# EAGLE board camion-grue (EAGLE 8.6.0), part 1 of 2
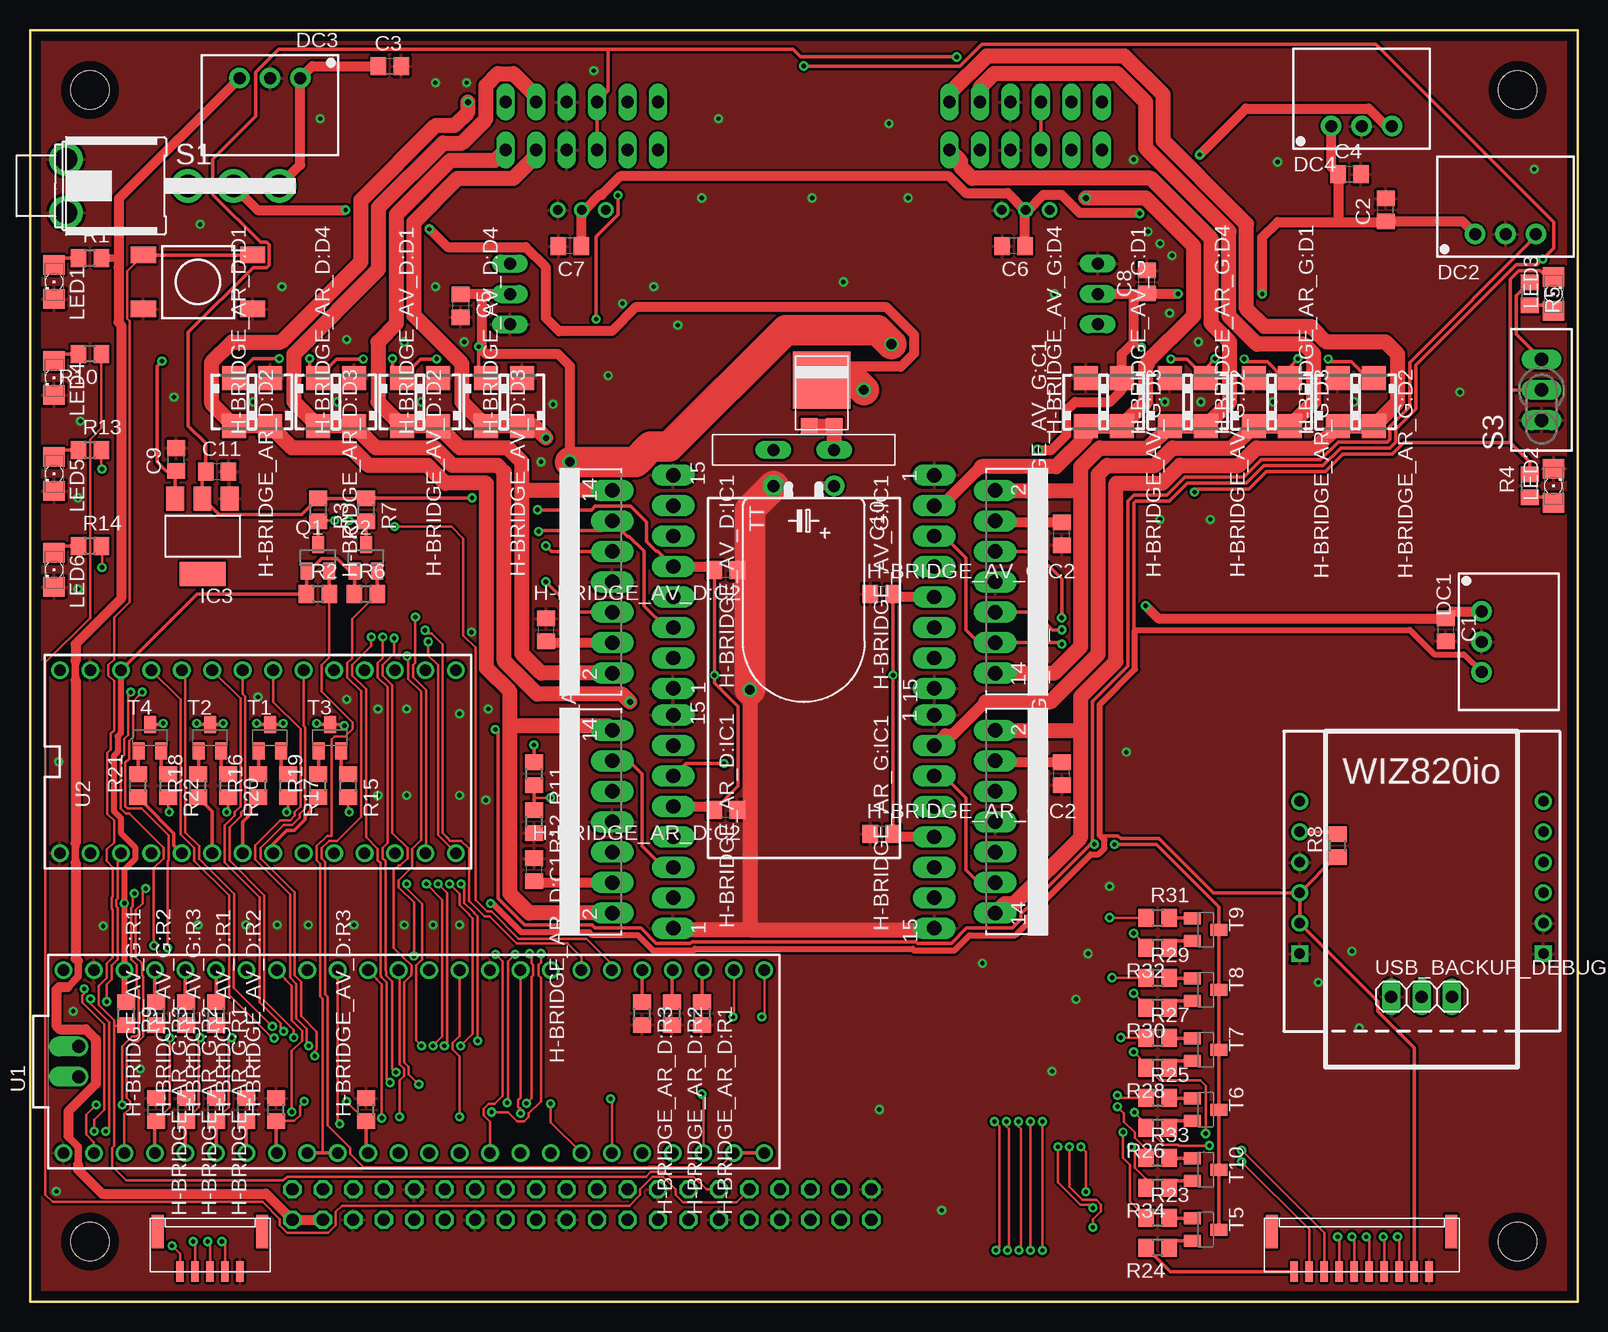
[diagram p2: board, top side]
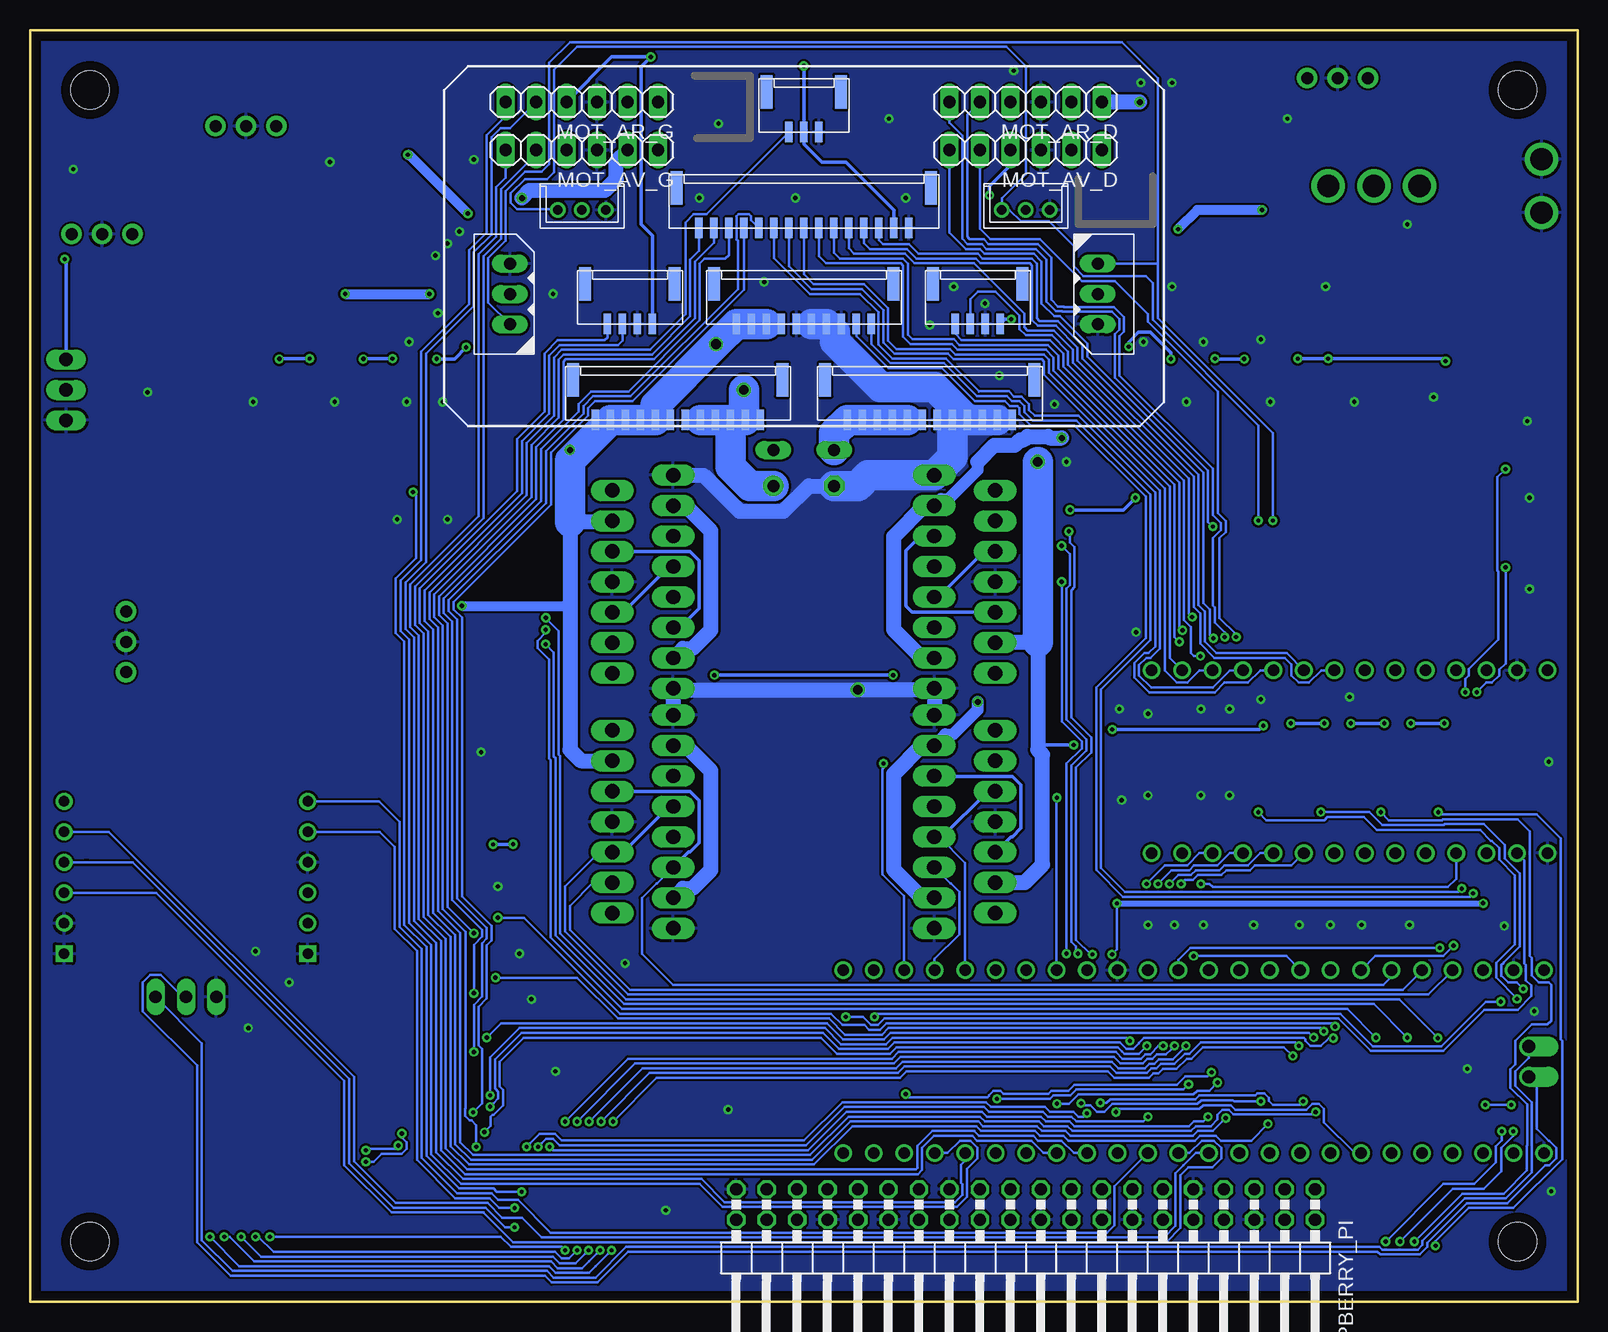
[diagram p3: board, bottom side, seen from below]

Size 129 x 106 mm. Coordinates in mm from the lower left corner, seen from the top.
Outline: 0,0 0,106 129,106 129,0 0,0
Copper layers (1*16): Top 0.035mm / dielectric 1.5mm / Bottom 0.035mm
Design rules "default *": minimum track width 0.2mm, minimum drill 0.35mm, track to track 0.2mm, track to pad 0.2mm, pad to pad 0.2mm, via to via 0.2mm, smd to smd 0.2mm, copper to edge 0.8mm, drill to drill 0.2mm, minimum pad ring 10mil, minimum via ring 8mil, stop-mask expansion 4mil, vias tented up to drill 1mm, thermal gap 10mil
Holes 3.2 mm at 5,5 5,101 124,101 124,5

## Footprints (pad centres in the part's own frame; a part is rotated, then mirrored left to right if it is on the bottom)
GH-12-V = smd 0.6 x 1.7: 1 -6.875,2.5; 2 -5.625,2.5; 3 -4.375,2.5; 4 -3.125,2.5; 5 -1.875,2.5; 6 -0.625,2.5; 7 0.625,2.5; 8 1.875,2.5; 9 3.125,2.5; 10 4.375,2.5; 11 5.625,2.5; 12 6.875,2.5 | smd 1 x 2.8: CASE0 8.725,-0.85; CASE1 -8.725,-0.85
DYNAMIXEL_AX_1X03 = drill 1 long: DATA 2.54,0; DYN_VCC 0,0; GND -2.54,0
C0805 = smd 1.3 x 1.5: 1 -0.95,0; 2 0.95,0
TT5D11L = drill 1 pad 1.676: + -2.54,0 | drill 1 pad 1.676 octagon: - 2.54,0
TO-277A = smd 1.4 x 1.27: +1 -1.04,-1; +2 1.04,-1 | smd 4.8 x 4.72: - 0,2.81
SIP3 = drill 1 pad 1.676: 1 -2.54,0; 2 0,0; 3 2.54,0
GH-05-V = smd 0.6 x 1.7: 1 -2.5,2.5; 2 -1.25,2.5; 3 0,2.5; 4 1.25,2.5; 5 2.5,2.5 | smd 1 x 2.8: CASE0 4.35,-0.85; CASE1 -4.35,-0.85
GH-15-V = smd 0.6 x 1.7: 1 -8.75,2.5; 2 -7.5,2.5; 3 -6.25,2.5; 4 -5,2.5; 5 -3.75,2.5; 6 -2.5,2.5; 7 -1.25,2.5; 8 0,2.5; 9 1.25,2.5; 10 2.5,2.5; 11 3.75,2.5; 12 5,2.5; 13 6.25,2.5; 14 7.5,2.5; 15 8.75,2.5 | smd 1 x 2.8: CASE0 10.6,-0.85; CASE1 -10.6,-0.85
GH-04-V = smd 0.6 x 1.7: 1 -1.875,2.5; 2 -0.625,2.5; 3 0.625,2.5; 4 1.875,2.5 | smd 1 x 2.8: CASE0 3.725,-0.85; CASE1 -3.725,-0.85
GH-10-V = smd 0.6 x 1.7: 1 -5.625,2.5; 2 -4.375,2.5; 3 -3.125,2.5; 4 -1.875,2.5; 5 -0.625,2.5; 6 0.625,2.5; 7 1.875,2.5; 8 3.125,2.5; 9 4.375,2.5; 10 5.625,2.5 | smd 1 x 2.8: CASE0 7.475,-0.85; CASE1 -7.475,-0.85
SMA = smd 2 x 2: A 2,0; C -2,0
MULTIWATT-15 = drill 1.2 long: 1 -8.89,-7.62; 2 -7.62,-2.54; 3 -6.35,-7.62; 4 -5.08,-2.54; 5 -3.81,-7.62; 6 -2.54,-2.54; 7 -1.27,-7.62; 8 0,-2.54; 9 1.27,-7.62; 10 2.54,-2.54; 11 3.81,-7.62; 12 5.08,-2.54; 13 6.35,-7.62; 14 7.62,-2.54; 15 8.89,-7.62
R0805 = smd 1.3 x 1.5: 1 -0.95,0; 2 0.95,0
SOT223 = smd 1.499 x 2.007: 1 -2.261,-3.15; 2 0.025,-3.15; 3 2.311,-3.15 | smd 3.81 x 2.007: 4 0,3.15
GH-03-V = smd 0.6 x 1.7: 1 -1.25,2.5; 2 0,2.5; 3 1.25,2.5 | smd 1 x 2.8: CASE0 3.1,-0.85; CASE1 -3.1,-0.85
1206 = smd 1.6 x 1.803: A -1.422,0; C 1.422,0
1X06 = drill 1.016 long: 1 -6.35,0; 2 -3.81,0; 3 -1.27,0; 4 1.27,0; 5 3.81,0; 6 6.35,0
5MM = drill 1 long: P$1 -2.54,0; P$2 2.54,0
SOT23 = smd 1 x 1.4: 1 -0.95,-1.1; 2 0.95,-1.1; 3 0,1.1
2X20/90 = drill 1.016 octagon: 1 -24.13,-6.35; 2 -24.13,-3.81; 3 -21.59,-6.35; 4 -21.59,-3.81; 5 -19.05,-6.35; 6 -19.05,-3.81; 7 -16.51,-6.35; 8 -16.51,-3.81; 9 -13.97,-6.35; 10 -13.97,-3.81; 11 -11.43,-6.35; 12 -11.43,-3.81; 13 -8.89,-6.35; 14 -8.89,-3.81; 15 -6.35,-6.35; 16 -6.35,-3.81; 17 -3.81,-6.35; 18 -3.81,-3.81; 19 -1.27,-6.35; 20 -1.27,-3.81; 21 1.27,-6.35; 22 1.27,-3.81; 23 3.81,-6.35; 24 3.81,-3.81; 25 6.35,-6.35; 26 6.35,-3.81; 27 8.89,-6.35; 28 8.89,-3.81; 29 11.43,-6.35; 30 11.43,-3.81; 31 13.97,-6.35; 32 13.97,-3.81; 33 16.51,-6.35; 34 16.51,-3.81; 35 19.05,-6.35; 36 19.05,-3.81; 37 21.59,-6.35; 38 21.59,-3.81; 39 24.13,-6.35; 40 24.13,-3.81
SWITCH_LPV-1 = drill 1.85: 1 0,10.16; 2 0,13.97; 3 0,17.78; B -2.225,0; B1 2.225,0
TL3XPO = drill 1.1 pad 1.422 long: 1 -2.54,0; 2 0,0; 3 2.54,0
SOT23-BEC = smd 1 x 1.4: B -0.95,-1.1; C 0,1.1; E 0.95,-1.1
TEENSY_3.5_DIL+USB = drill 0.965: 0 -7.62,26.67; 1 -7.62,24.13; 2 -7.62,21.59; 3 -7.62,19.05; 3.3V 7.62,24.13; 3.3V3 -7.62,-6.35; 4 -7.62,16.51; 5 -7.62,13.97; 6 -7.62,11.43; 7 -7.62,8.89; 8 -7.62,6.35; 9 -7.62,3.81; 10 -7.62,1.27; 11 -7.62,-1.27; 12 -7.62,-3.81; 13 7.62,-3.81; 14/A0 7.62,-1.27; 15/A1 7.62,1.27; 16/A2 7.62,3.81; 17/A3 7.62,6.35; 18/A4 7.62,8.89; 19/A5 7.62,11.43; 20/A6 7.62,13.97; 21/A7 7.62,16.51; 22/A8 7.62,19.05; 23/A9 7.62,21.59; 24 -7.62,-8.89; 25 -7.62,-11.43; 26 -7.62,-13.97; 27 -7.62,-16.51; 28 -7.62,-19.05; 29 -7.62,-21.59; 30 -7.62,-24.13; 31/A12 -7.62,-26.67; 32/A13 -7.62,-29.21; 33/A14 7.62,-29.21; 34/A15 7.62,-26.67; 35/A16 7.62,-24.13; 36/A17 7.62,-21.59; 37/A18 7.62,-19.05; 38/A19 7.62,-16.51; 39/A20 7.62,-13.97; A21 7.62,-11.43; A22 7.62,-8.89; AGND 7.62,26.67; GND -7.62,29.21; GND1 7.62,-6.35; VIN 7.62,29.21 | drill 1.1 offset: USBD+ -1.27,27.94; USBD- 1.27,27.94
TEENSY_3.0-3.2&LC_DIL = drill 0.965: 0 -7.62,13.97; 1 -7.62,11.43; 2 -7.62,8.89; 3 -7.62,6.35; 3.3V 7.62,11.43; 4 -7.62,3.81; 5 -7.62,1.27; 6 -7.62,-1.27; 7 -7.62,-3.81; 8 -7.62,-6.35; 9 -7.62,-8.89; 10 -7.62,-11.43; 11 -7.62,-13.97; 12 -7.62,-16.51; 13 7.62,-16.51; 14/A0 7.62,-13.97; 15/A1 7.62,-11.43; 16/A2 7.62,-8.89; 17/A3 7.62,-6.35; 18/A4 7.62,-3.81; 19/A5 7.62,-1.27; 20/A6 7.62,1.27; 21/A7 7.62,3.81; 22/A8 7.62,6.35; 23/A9 7.62,8.89; AGND 7.62,13.97; GND -7.62,16.51; VIN 7.62,16.51
PUSH-BUTTON = smd 1.4 x 2.1: 1 2.25,4.55; 2 2.25,-4.55; 3 -2.25,4.55; 4 -2.25,-4.55
WIZ820 = drill 0.9 square: GND1 -10.16,0; GND3 10.16,0 | drill 0.9: GND2 -10.16,-2.54; INT -10.16,-12.7; MISO 10.16,-12.7; MOSI -10.16,-5.08; PWDN 10.16,-7.62; RESET 10.16,-10.16; SCLK -10.16,-7.62; SS -10.16,-10.16; VIN1 10.16,-2.54; VIN2 10.16,-5.08
1X03 = drill 1.016 long: 1 -2.54,0; 2 0,0; 3 2.54,0
DYNAMIXEL_XL_1X03 = drill 0.8: DATA 2,0; GND -2,0; VCC 0,0

## Placement (x,y rotation side)
ARRET_URGENCE  JST-12  [GH-12-V]  75,76 180 bottom
AX12_D  DYNAMIXEL-1X03AX  [DYNAMIXEL_AX_1X03]  40,84 90 bottom
AX12_G  DYNAMIXEL-1X03AX  [DYNAMIXEL_AX_1X03]  89,84 270 bottom
C1  10µF  [C0805]  118,56 270 top
C2  10µF  [C0805]  113,91 90 top
C3  10µF  [C0805]  30,103 0 top
C4  10µF  [C0805]  110,94 0 top
C5  1µF  [C0805]  35.9,83 270 top
C6  1µF  [C0805]  82,88 180 top
C7  1µF  [C0805]  45,88 180 top
C8  1µF  [C0805]  93.1,85 90 top
C9  10µF  [C0805]  12.2,70.2 90 top
C10  4700µF  [TT5D11L]  64.5,68 180 top
C11  22µF  [C0805]  15.6,69.2 0 top
D1  DIODE_S15P45  [TO-277A]  66,74 0 top
DC1  R-78C3.3-1.0  [SIP3]  121,55 270 top
DC2  R-78C3.3-1.0  [SIP3]  123,89 0 top
DC3  R-78C5.0-1.0  [SIP3]  20,102 180 top
DC4  R-78C9.0-1.0  [SIP3]  111,98 0 top
DEL_GYRO  JST-05  [GH-05-V]  15,5 180 top
DELS_ET_TOF_AR  JST-15  [GH-15-V]  64.5,92 180 bottom
ENCODEUR_DROIT  JST-04GH-V  [GH-04-V]  50,84 180 bottom
ENCODEUR_GAUCHE  JST-04GH-V  [GH-04-V]  79,84 180 bottom
GRUE  JST-10  [GH-10-V]  64.5,84 180 bottom
H-BRIDGE_AR_D:C1  100nF  [C0805]  42,36 270 top
H-BRIDGE_AR_D:C2  100nF  [C0805]  58,41 180 top
H-BRIDGE_AR_D:D1  S1M  [SMA]  20,75 90 top
H-BRIDGE_AR_D:D2  S1M  [SMA]  17,75 270 top
H-BRIDGE_AR_D:D3  S1M  [SMA]  24,75 270 top
H-BRIDGE_AR_D:D4  S1M  [SMA]  27,75 90 top
H-BRIDGE_AR_D:IC1  L298  [MULTIWATT-15]  46,40 90 top
H-BRIDGE_AR_D:R1  10k  [R0805]  56,24 270 top
H-BRIDGE_AR_D:R2  10k  [R0805]  53.5,24 270 top
H-BRIDGE_AR_D:R3  10k  [R0805]  51,24 270 top
H-BRIDGE_AR_G:C1  100nF  [C0805]  86,44 90 top
H-BRIDGE_AR_G:C2  100nF  [C0805]  71,39 0 top
H-BRIDGE_AR_G:D1  S1M  [SMA]  109,75 90 top
H-BRIDGE_AR_G:D2  S1M  [SMA]  112,75 270 top
H-BRIDGE_AR_G:D3  S1M  [SMA]  105,75 270 top
H-BRIDGE_AR_G:D4  S1M  [SMA]  102,75 90 top
H-BRIDGE_AR_G:IC1  L298  [MULTIWATT-15]  83,40 270 top
H-BRIDGE_AR_G:R1  10k  [R0805]  15.5,24 270 top
H-BRIDGE_AR_G:R2  10k  [R0805]  13,24 270 top
H-BRIDGE_AR_G:R3  10k  [R0805]  10.5,24 270 top
H-BRIDGE_AV_D:C1  100nF  [C0805]  43,56 270 top
H-BRIDGE_AV_D:C2  100nF  [C0805]  58,61 180 top
H-BRIDGE_AV_D:D1  S1M  [SMA]  34,75 90 top
H-BRIDGE_AV_D:D2  S1M  [SMA]  31,75 270 top
H-BRIDGE_AV_D:D3  S1M  [SMA]  38,75 270 top
H-BRIDGE_AV_D:D4  S1M  [SMA]  41,75 90 top
H-BRIDGE_AV_D:IC1  L298  [MULTIWATT-15]  46,60 90 top
H-BRIDGE_AV_D:R1  10k  [R0805]  18,16 90 top
H-BRIDGE_AV_D:R2  10k  [R0805]  20.5,16 90 top
H-BRIDGE_AV_D:R3  10k  [R0805]  28,16 90 top
H-BRIDGE_AV_G:C1  100nF  [C0805]  86,64 90 top
H-BRIDGE_AV_G:C2  100nF  [C0805]  71,59 0 top
H-BRIDGE_AV_G:D1  S1M  [SMA]  95,75 90 top
H-BRIDGE_AV_G:D2  S1M  [SMA]  98,75 270 top
H-BRIDGE_AV_G:D3  S1M  [SMA]  91,75 270 top
H-BRIDGE_AV_G:D4  S1M  [SMA]  88,75 90 top
H-BRIDGE_AV_G:IC1  L298  [MULTIWATT-15]  83,60 270 top
H-BRIDGE_AV_G:R1  10k  [R0805]  10.5,16 90 top
H-BRIDGE_AV_G:R2  10k  [R0805]  13,16 90 top
H-BRIDGE_AV_G:R3  10k  [R0805]  15.5,16 90 top
IC3  REG1117  [SOT223]  14.4,63.8 180 top
JUMPER  JST-03  [GH-03-V]  64.5,100 180 bottom
LED1  blue  [1206]  2,85 270 top
LED2  green  [1206]  127,68 90 top
LED3  orange  [1206]  127,84 90 top
LED4  red  [1206]  2,77 270 top
LED5  blue  [1206]  2,69 270 top
LED6  red  [1206]  2,61 270 top
LIPO  JST-12  [GH-12-V]  54,76 180 bottom
MOT_AR_D  [1X06]  46,100 180 bottom
MOT_AR_G  [1X06]  83,100 180 bottom
MOT_AV_D  [1X06]  46,96 180 bottom
MOT_AV_G  [1X06]  83,96 180 bottom
P1  RGEF800  [5MM]  64.5,71 180 top
PHARES_ET_TOF_AV  JST-10  [GH-10-V]  111,5 180 top
Q1  BSS138  [SOT23]  24,62 0 top
Q2  BSS138  [SOT23]  28,62 0 top
R1  470  [R0805]  5,87 0 top
R2  10k  [R0805]  24,59 0 top
R3  10k  [R0805]  24,66 270 top
R4  330  [R0805]  125,68 90 top
R5  330  [R0805]  125,84 270 top
R6  10k  [R0805]  28,59 0 top
R7  10k  [R0805]  28,66 270 top
R8  10k  [R0805]  109,38 90 top
R9  10k  [R0805]  8,24 270 top
R10  330  [R0805]  5,79 180 top
R11  22k  [R0805]  42,44 270 top
R12  6k8  [R0805]  42,40 270 top
R13  330  [R0805]  5,71 0 top
R14  330  [R0805]  5,63 0 top
R15  0  [R0805]  26.5,43 270 top
R16  270  [R0805]  19,43 90 top
R17  0  [R0805]  21.5,43 270 top
R18  270  [R0805]  14,43 90 top
R19  270  [R0805]  24,43 90 top
R20  0  [R0805]  16.5,43 270 top
R21  270  [R0805]  9,43 90 top
R22  0  [R0805]  11.5,43 270 top
R23  270  [R0805]  94,7 0 top
R24  0  [R0805]  94,4.5 180 top
R25  270  [R0805]  94,17 0 top
R26  0  [R0805]  94,14.5 180 top
R27  270  [R0805]  94,22 0 top
R28  0  [R0805]  94,19.5 180 top
R29  270  [R0805]  94,27 0 top
R30  0  [R0805]  94,24.5 180 top
R31  270  [R0805]  94,32 0 top
R32  0  [R0805]  94,29.5 180 top
R33  270  [R0805]  94,12 0 top
R34  0  [R0805]  94,9.5 180 top
RASPPBERRY_PI  [2X20/90]  46,3 180 bottom
S1  [SWITCH_LPV-1]  3,93 270 top
S3  TL36PO  [TL3XPO]  126,76 90 top
T1  [SOT23-BEC]  20,47 0 top
T2  [SOT23-BEC]  15,47 0 top
T3  [SOT23-BEC]  25,47 0 top
T4  [SOT23-BEC]  10,47 0 top
T5  [SOT23-BEC]  98,6 270 top
T6  [SOT23-BEC]  98,16 270 top
T7  [SOT23-BEC]  98,21 270 top
T8  [SOT23-BEC]  98,26 270 top
T9  [SOT23-BEC]  98,31 270 top
T10  [SOT23-BEC]  98,11 270 top
U1  TEENSY_3.5_DIL+USB  [TEENSY_3.5_DIL+USB]  32,20 90 top
U2  TEENSY_3.1-3.2_DIL  [TEENSY_3.0-3.2&LC_DIL]  19,45 90 top
U$2  PUSH-BUTTON  [PUSH-BUTTON]  14,85 270 top
U$3  WIZ820IO  [WIZ820]  116,29 180 top
USB_BACKUP_DEBUG  [1X03]  116,25.4 0 top
XL320_D  DYNAMIXEL-1X03XL  [DYNAMIXEL_XL_1X03]  46,91 180 bottom
XL320_G  DYNAMIXEL-1X03XL  [DYNAMIXEL_XL_1X03]  83,91 180 bottom